# EAGLE design nedonand7 (EAGLE 5.12)
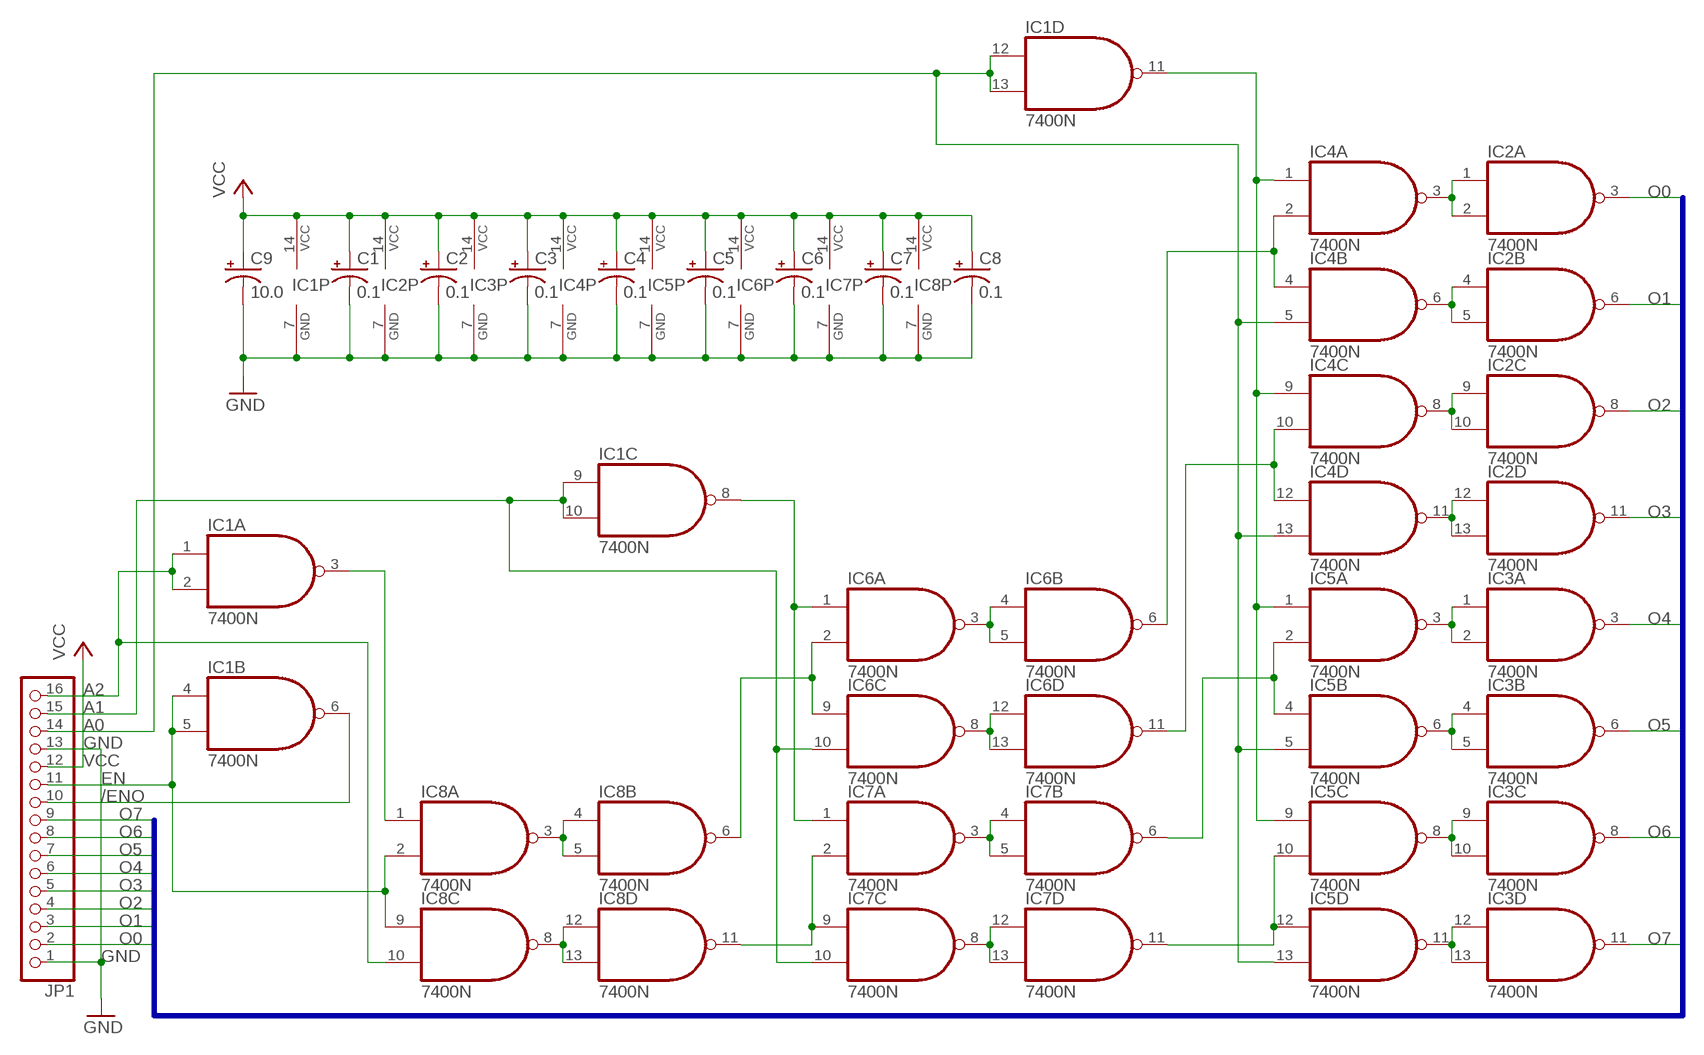
[diagram p0: schematic, sheet 1]

## Parts
C1  0.1  CPOL-USB45181A  [B45181A]
C2  0.1  CPOL-USB45181A  [B45181A]
C3  0.1  CPOL-USB45181A  [B45181A]
C4  0.1  CPOL-USB45181A  [B45181A]
C5  0.1  CPOL-USB45181A  [B45181A]
C6  0.1  CPOL-USB45181A  [B45181A]
C7  0.1  CPOL-USB45181A  [B45181A]
C8  0.1  CPOL-USB45181A  [B45181A]
C9  10.0  CPOL-USE2,5-6E  [E2,5-6E]
IC1  7400N  [DIL14]
IC2  7400N  [DIL14]
IC3  7400N  [DIL14]
IC4  7400N  [DIL14]
IC5  7400N  [DIL14]
IC6  7400N  [DIL14]
IC7  7400N  [DIL14]
IC8  7400N  [DIL14]
JP1  PINHD-1X16/90  [1X16/90]

## Nets
/ENO: IC1.6(B:O) JP1.10
A0: IC1.12(D:I0) IC1.13(D:I1) IC4.5(B:I1) IC4.13(D:I1) IC5.5(B:I1) IC5.13(D:I1) JP1.14
A1: IC1.9(C:I0) IC1.10(C:I1) IC6.10(C:I1) IC7.10(C:I1) JP1.15
A2: IC1.1(A:I0) IC1.2(A:I1) IC8.10(C:I1) JP1.16
EN: IC1.4(B:I0) IC1.5(B:I1) IC8.2(A:I1) IC8.9(C:I0) JP1.11
GND: C1.- C2.- C3.- C4.- C5.- C6.- C7.- C8.- C9.- IC1.7(P:GND) IC2.7(P:GND) IC3.7(P:GND) IC4.7(P:GND) IC5.7(P:GND) IC6.7(P:GND) IC7.7(P:GND) IC8.7(P:GND) JP1.1 JP1.13
N$1: IC8.3(A:O) IC8.4(B:I0) IC8.5(B:I1)
N$2: IC7.2(A:I1) IC7.9(C:I0) IC8.11(D:O)
N$7: IC8.8(C:O) IC8.12(D:I0) IC8.13(D:I1)
N$8: IC6.3(A:O) IC6.4(B:I0) IC6.5(B:I1)
N$9: IC6.8(C:O) IC6.12(D:I0) IC6.13(D:I1)
N$10: IC7.3(A:O) IC7.4(B:I0) IC7.5(B:I1)
N$11: IC7.8(C:O) IC7.12(D:I0) IC7.13(D:I1)
N$12: IC2.1(A:I0) IC2.2(A:I1) IC4.3(A:O)
N$13: IC2.4(B:I0) IC2.5(B:I1) IC4.6(B:O)
N$14: IC2.9(C:I0) IC2.10(C:I1) IC4.8(C:O)
N$15: IC2.12(D:I0) IC2.13(D:I1) IC4.11(D:O)
N$16: IC3.1(A:I0) IC3.2(A:I1) IC5.3(A:O)
N$17: IC3.4(B:I0) IC3.5(B:I1) IC5.6(B:O)
N$18: IC3.9(C:I0) IC3.10(C:I1) IC5.8(C:O)
N$19: IC3.12(D:I0) IC3.13(D:I1) IC5.11(D:O)
N$25: IC1.3(A:O) IC8.1(A:I0)
N$26: IC6.2(A:I1) IC6.9(C:I0) IC8.6(B:O)
N$28: IC1.8(C:O) IC6.1(A:I0) IC7.1(A:I0)
N$30: IC4.2(A:I1) IC4.4(B:I0) IC6.6(B:O)
N$31: IC4.10(C:I1) IC4.12(D:I0) IC6.11(D:O)
N$32: IC5.2(A:I1) IC5.4(B:I0) IC7.6(B:O)
N$33: IC5.10(C:I1) IC5.12(D:I0) IC7.11(D:O)
N$34: IC1.11(D:O) IC4.1(A:I0) IC4.9(C:I0) IC5.1(A:I0) IC5.9(C:I0)
O0: IC2.3(A:O) JP1.2
O1: IC2.6(B:O) JP1.3
O2: IC2.8(C:O) JP1.4
O3: IC2.11(D:O) JP1.5
O4: IC3.3(A:O) JP1.6
O5: IC3.6(B:O) JP1.7
O6: IC3.8(C:O) JP1.8
O7: IC3.11(D:O) JP1.9
VCC: C1.+ C2.+ C3.+ C4.+ C5.+ C6.+ C7.+ C8.+ C9.+ IC1.14(P:VCC) IC2.14(P:VCC) IC3.14(P:VCC) IC4.14(P:VCC) IC5.14(P:VCC) IC6.14(P:VCC) IC7.14(P:VCC) IC8.14(P:VCC) JP1.12

## Buses
O[0..7]

## Library data of the parts
C1-C9 = rcl:CPOL-US: POLARIZED CAPACITOR, American symbol
IC1-IC8 = 74xx-us:74*00: Quad 2-input NAND gate
JP1 = pinhead:PINHD-1X16: PIN HEADER

## Board
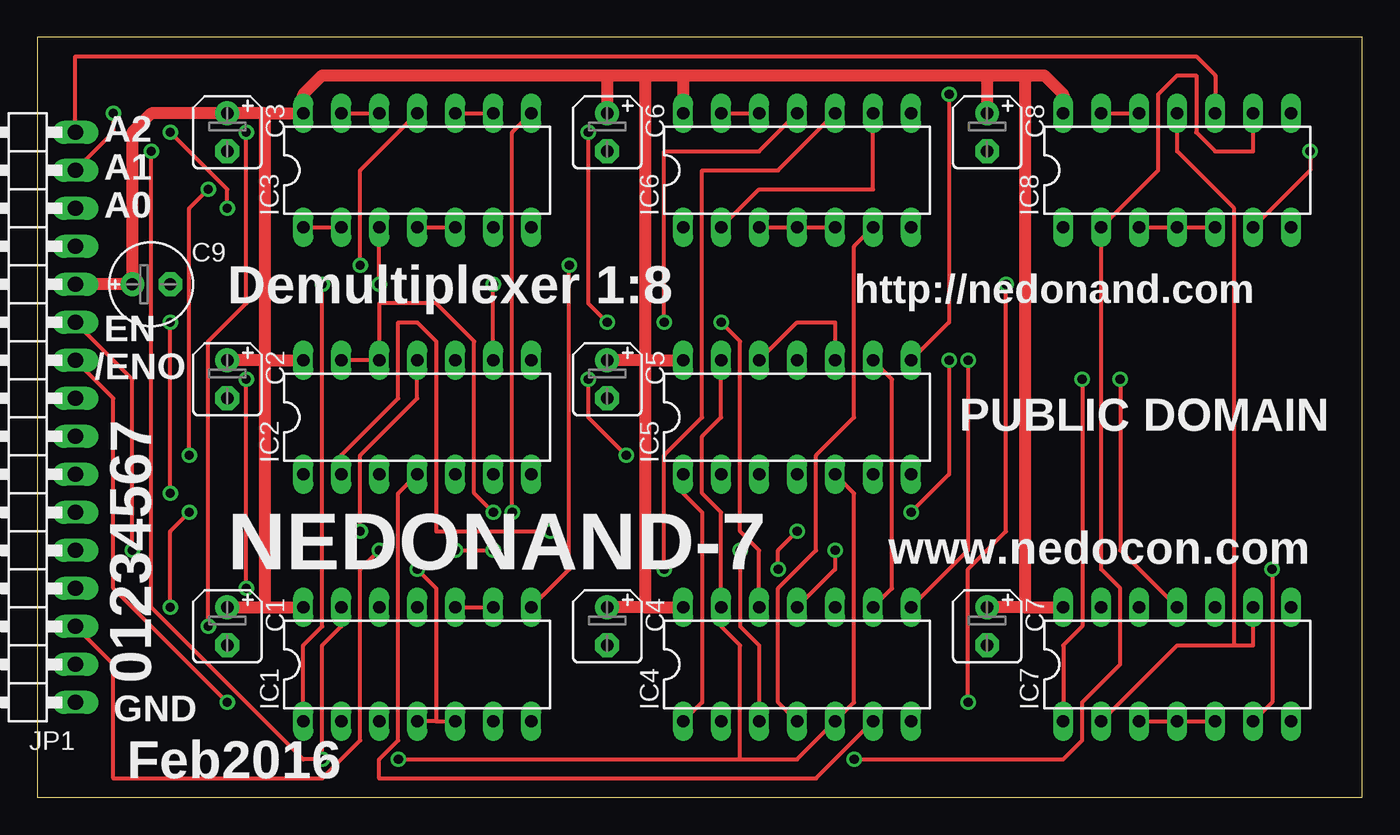
[diagram p1: board, top side]
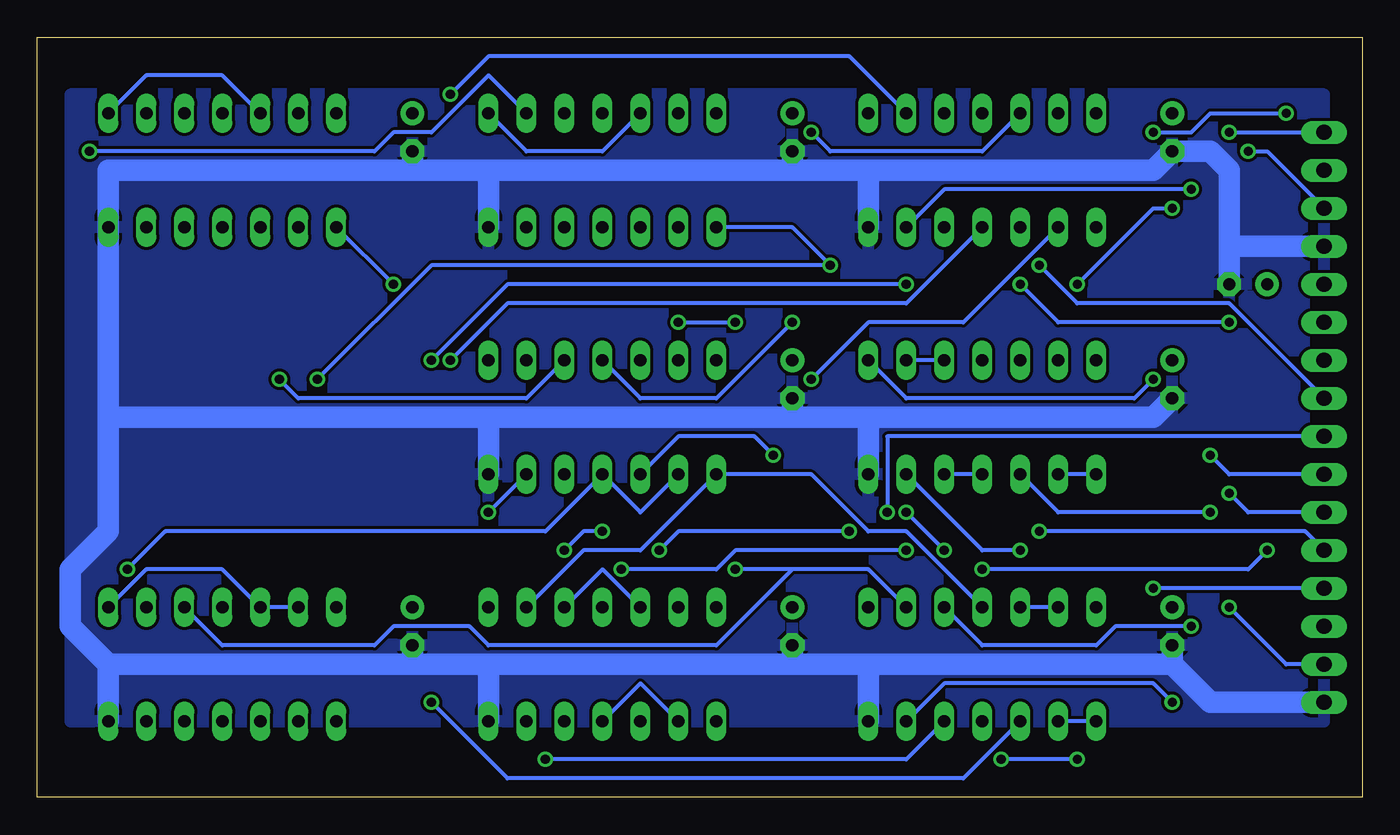
[diagram p2: board, bottom side, seen from below]

Size 88.57 x 50.79 mm. Coordinates in mm from the lower left corner, seen from the top.
Outline: 0,0 88.57,0 88.57,50.79 0,50.79 0,0
Copper layers (1*16): Top 0.035mm / dielectric 1.5mm / Bottom 0.035mm
Design rules "default": minimum track width 10mil, minimum drill 24mil, track to track 8mil, track to pad 8mil, pad to pad 8mil, via to via 8mil, smd to smd 8mil, copper to edge 40mil, drill to drill 8mil, minimum pad ring 10mil, minimum via ring 8mil, stop-mask expansion 4mil, vias tented up to drill 0mil, thermal gap 10mil

### Footprints (pad centres in the part's own frame; a part is rotated, then mirrored left to right if it is on the bottom)
B45181A = drill 0.813 pad 1.6 round: + -1.27,0 | drill 0.813 pad 1.6 octagon: - 1.27,0
E2,5-6E = drill 0.813 pad 1.575 round: + -1.27,0 | drill 0.813 pad 1.575 octagon: - 1.27,0
DIL14 = drill 0.813 long: 1 -7.62,-3.81; 2 -5.08,-3.81; 3 -2.54,-3.81; 4 0,-3.81; 5 2.54,-3.81; 6 5.08,-3.81; 7 7.62,-3.81; 8 7.62,3.81; 9 5.08,3.81; 10 2.54,3.81; 11 0,3.81; 12 -2.54,3.81; 13 -5.08,3.81; 14 -7.62,3.81
1X16/90 = drill 1.016 long: 1 -19.05,-3.81; 2 -16.51,-3.81; 3 -13.97,-3.81; 4 -11.43,-3.81; 5 -8.89,-3.81; 6 -6.35,-3.81; 7 -3.81,-3.81; 8 -1.27,-3.81; 9 1.27,-3.81; 10 3.81,-3.81; 11 6.35,-3.81; 12 8.89,-3.81; 13 11.43,-3.81; 14 13.97,-3.81; 15 16.51,-3.81; 16 19.05,-3.81

### Placement (x,y rotation side)
C1  12.7,11.43 270 top
C2  12.7,27.94 270 top
C3  12.7,44.45 270 top
C4  38.1,11.43 270 top
C5  38.1,27.94 270 top
C6  38.1,44.45 270 top
C7  63.5,11.43 270 top
C8  63.5,44.45 270 top
C9  7.62,34.29 0 top
IC1  25.4,8.89 0 top
IC2  25.4,25.4 0 top
IC3  25.4,41.91 0 top
IC4  50.8,8.89 0 top
IC5  50.8,25.4 0 top
IC6  50.8,41.91 0 top
IC7  76.2,8.89 0 top
IC8  76.2,41.91 0 top
JP1  -1.27,25.4 90 top

### Tracks (layer width: path | path; a pad name or v marks a point on that pad's centre or on a via)
/ENO  (via drill 0.61)
  Top 0.254: v12.7,6.35 5.08,13.97 5.08,26.67 JP1.10
  Bottom 0.254: IC1.6 27.94,7.62 13.97,7.62 v12.7,6.35
A0  (via drill 0.61)
  Top 0.254: IC5.5 54.61,20.32 54.61,6.35 IC4.5 50.8,2.54 46.99,2.54 | IC5.13 45.72,25.4 44.45,24.13 44.45,20.32 45.72,19.05 IC4.13 45.72,11.43 46.99,10.16 46.99,2.54 | v7.62,43.18 7.62,12.7 17.78,2.54 v19.05,2.54 19.05,10.16 20.32,11.43 IC1.13 | v24.13,2.54 46.99,2.54
  Bottom 0.254: IC1.13 IC1.12 | JP1.14 6.35,43.18 v7.62,43.18 | v19.05,2.54 v24.13,2.54
A1  (via drill 0.61)
  Top 0.254: IC1.10 IC1.9 | IC6.10 49.53,41.91 44.45,41.91 44.45,25.4 41.91,22.86 v41.91,15.24 | JP1.15 5.08,44.45 v5.08,45.72 | v13.97,44.45 13.97,33.02 11.43,30.48 v11.43,11.43
  Bottom 0.254: 38.1,15.24 33.02,15.24 IC1.9 | 38.1,15.24 v41.91,15.24 | IC7.10 76.2,10.16 66.04,10.16 64.77,11.43 59.69,11.43 58.42,10.16 43.18,10.16 38.1,15.24 | v5.08,45.72 10.16,45.72 11.43,44.45 v13.97,44.45 | v11.43,11.43 16.51,11.43 17.78,10.16 25.4,10.16 IC1.10
A2  (via drill 0.61)
  Top 0.254: IC8.10 78.74,48.26 77.47,49.53 2.54,49.53 JP1.16 | IC1.1 17.78,10.16 19.05,11.43 v19.05,34.29 | v12.7,39.37 12.7,40.64 v8.89,44.45
  Bottom 0.254: IC1.1 IC1.2 | v19.05,34.29 13.97,39.37 v12.7,39.37 | v8.89,44.45 JP1.16
EN  (via drill 0.61)
  Top 0.254: IC8.9 81.28,43.18 78.74,43.18 77.47,44.45 77.47,48.26 76.2,48.26 74.93,46.99 74.93,41.91 IC8.2 71.12,15.24 72.39,13.97 72.39,8.89 69.85,6.35 69.85,3.81 68.58,2.54 v54.61,2.54 | 26.67,5.08 IC1.5 | 26.67,5.08 IC1.4 | JP1.11 6.35,27.94 v6.35,16.51 | v25.4,15.24 26.67,13.97 26.67,5.08
  Bottom 0.254: v6.35,16.51 7.62,15.24 v25.4,15.24 | v54.61,2.54 30.48,2.54 IC1.5
GND
  Bottom 1.422: JP1.1 10.16,6.35 12.7,8.89 | 12.7,8.89 C1.- | 83.82,8.89 IC7.7 | 12.7,8.89 33.02,8.89 | 33.02,8.89 38.1,8.89 | 38.1,8.89 58.42,8.89 | 58.42,8.89 63.5,8.89 | 63.5,8.89 83.82,8.89 | 83.82,25.4 83.82,17.78 86.36,15.24 86.36,11.43 83.82,8.89 | 83.82,25.4 IC8.7 83.82,41.91 63.5,41.91 | 8.89,36.83 JP1.13 | 8.89,36.83 C9.- | 8.89,36.83 8.89,41.91 10.16,43.18 C3.- 13.97,41.91 33.02,41.91 | 33.02,41.91 IC3.7 | 63.5,41.91 58.42,41.91 | 58.42,41.91 38.1,41.91 | 38.1,41.91 33.02,41.91 | 63.5,41.91 C8.- | 58.42,41.91 IC6.7 | 38.1,41.91 C6.- | 63.5,8.89 C7.- | 38.1,8.89 C4.- | 33.02,8.89 IC1.7 | 58.42,8.89 IC4.7 | C2.- 13.97,25.4 33.02,25.4 | 83.82,25.4 58.42,25.4 | 58.42,25.4 38.1,25.4 | 38.1,25.4 33.02,25.4 | 58.42,25.4 IC5.7 | 38.1,25.4 C5.- | 33.02,25.4 IC2.7
  pour Bottom: 2.54,46.99 86.36,46.99 86.36,5.08 2.54,5.08
N$1
  Top 0.254: IC8.3 IC8.4 IC8.5
N$2
  Top 0.254: IC7.2 76.2,10.16 80.01,10.16 | 80.01,10.16 81.28,10.16 IC7.9 | IC8.11 76.2,43.18 80.01,39.37 80.01,10.16
N$7
  Top 0.254: IC8.13 IC8.12
  Bottom 0.254: IC8.8 81.28,48.26 76.2,48.26 IC8.12
N$8
  Top 0.254: IC6.3 IC6.4 IC6.5
N$9
  Top 0.254: IC6.13 IC6.12
  Bottom 0.254: IC6.8 55.88,43.18 50.8,43.18 IC6.12
N$10
  Top 0.254: IC7.3 IC7.4 IC7.5
N$11
  Bottom 0.254: IC7.13 IC7.12 76.2,15.24 81.28,15.24 IC7.8
N$12  (via drill 0.61)
  Top 0.254: IC4.3 48.26,10.16 46.99,11.43 v46.99,16.51 | v34.29,17.78 26.67,17.78 26.67,30.48 25.4,31.75 24.13,31.75 24.13,26.67 20.32,22.86 IC2.2
  Bottom 0.254: IC2.1 IC2.2 | v46.99,16.51 45.72,17.78 v34.29,17.78
N$13
  Top 0.254: IC4.6 52.07,1.27 22.86,1.27 22.86,2.54 24.13,3.81 24.13,20.32 IC2.4
  Bottom 0.254: IC2.4 IC2.5
N$14  (via drill 0.61)
  Top 0.254: IC4.8 62.23,16.51 v62.23,29.21 | IC2.9 v30.48,34.29
  Bottom 0.254: IC2.10 IC2.9 | v62.23,29.21 57.15,34.29 v30.48,34.29
N$15  (via drill 0.61)
  Top 0.254: IC2.13 IC2.12 22.86,33.02 26.67,33.02 29.21,30.48 29.21,20.32 v30.48,19.05 | IC4.11 53.34,15.24 v53.34,16.51 | v50.8,17.78 49.53,16.51 v49.53,15.24 | v27.94,16.51 v30.48,16.51
  Bottom 0.254: v53.34,16.51 52.07,17.78 v50.8,17.78 | v49.53,15.24 43.18,15.24 41.91,16.51 v30.48,16.51 | v27.94,16.51 v30.48,19.05
N$16  (via drill 0.61)
  Top 0.254: IC3.1 IC3.2 | v39.37,22.86 36.83,25.4 v36.83,27.94
  Bottom 0.254: IC5.3 45.72,24.13 40.64,24.13 v39.37,22.86 | v36.83,27.94 33.02,31.75 26.67,31.75 IC3.2
N$17  (via drill 0.61)
  Top 0.254: IC3.4 IC3.5 | v58.42,19.05 60.96,21.59 v60.96,29.21
  Bottom 0.254: v58.42,19.05 IC5.6 | v60.96,29.21 57.15,33.02 30.48,33.02 IC3.4
N$18  (via drill 0.61)
  Top 0.254: IC3.10 IC3.9 | IC5.8 60.96,31.75 v60.96,46.99
  Bottom 0.254: v60.96,46.99 58.42,49.53 34.29,49.53 IC3.9
N$19  (via drill 0.61)
  Top 0.254: IC3.13 IC3.12 | v38.1,31.75 36.83,33.02 v36.83,44.45
  Bottom 0.254: IC5.11 48.26,26.67 43.18,26.67 v38.1,31.75 | v36.83,44.45 35.56,43.18 25.4,43.18 IC3.12
N$25  (via drill 0.61)
  Top 0.254: v62.23,6.35 62.23,15.24 64.77,17.78 v64.77,34.29
  Bottom 0.254: IC1.3 26.67,1.27 57.15,1.27 v62.23,6.35 | v64.77,34.29 IC8.1
N$26  (via drill 0.61)
  Top 0.254: IC6.2 48.26,40.64 55.88,40.64 IC6.9 | IC8.6 85.09,41.91 v85.09,43.18
  Bottom 0.254: v85.09,43.18 66.04,43.18 64.77,44.45 62.23,44.45 58.42,48.26 IC6.9
N$28  (via drill 0.61)
  Top 0.254: IC1.8 35.56,15.24 v35.56,35.56 | IC7.1 68.58,10.16 69.85,11.43 v69.85,27.94
  Bottom 0.254: IC6.1 38.1,38.1 v35.56,35.56 62.23,35.56 v69.85,27.94
N$30
  Top 0.254: IC6.6 54.61,36.83 54.61,25.4 52.07,22.86 52.07,16.51 49.53,13.97 49.53,6.35 IC4.4
  Bottom 0.254: IC4.2 48.26,7.62 IC4.4
N$31  (via drill 0.61)
  Top 0.254: IC6.11 48.26,43.18 41.91,43.18 v41.91,31.75 | v45.72,31.75 46.99,30.48 46.99,17.78 48.26,16.51 IC4.12
  Bottom 0.254: IC4.12 50.8,15.24 IC4.10 | v45.72,31.75 v41.91,31.75
N$32  (via drill 0.61)
  Top 0.254: IC7.6 82.55,6.35 v82.55,15.24
  Bottom 0.254: IC5.2 48.26,19.05 IC5.4 54.61,17.78 80.01,17.78 v82.55,15.24
N$33  (via drill 0.61)
  Top 0.254: IC5.12 50.8,31.75 53.34,31.75 IC5.10 | IC7.11 72.39,16.51 v72.39,27.94
  Bottom 0.254: v72.39,27.94 71.12,26.67 55.88,26.67 IC5.10
N$34
  Top 0.254: IC4.1 44.45,6.35 44.45,19.05 43.18,20.32 IC5.1 | IC5.9 57.15,27.94 57.15,13.97 IC4.9
  Bottom 0.254: IC1.11 30.48,17.78 33.02,17.78 36.83,21.59 IC5.1 48.26,16.51 52.07,16.51 IC4.9
O0  (via drill 0.61)
  Top 0.254: v10.16,19.05 8.89,17.78 v8.89,12.7
  Bottom 0.254: IC2.3 20.32,19.05 v10.16,19.05 | v8.89,12.7 5.08,8.89 JP1.2
O1  (via drill 0.61)
  Top 0.254: v22.86,16.51 21.59,15.24 21.59,3.81 19.05,1.27 5.08,1.27 5.08,8.89 JP1.3
  Bottom 0.254: IC2.6 25.4,16.51 v22.86,16.51
O2  (via drill 0.61)
  Top 0.254: v13.97,13.97 v13.97,27.94
  Bottom 0.254: IC2.8 30.48,26.67 15.24,26.67 v13.97,27.94 | JP1.4 v13.97,13.97
O3  (via drill 0.61)
  Top 0.254: IC2.11 25.4,26.67 21.59,22.86 v21.59,17.78
  Bottom 0.254: v21.59,17.78 3.81,17.78 JP1.5
O4  (via drill 0.61)
  Top 0.254: v22.86,34.29 IC3.3 | v8.89,20.32 v8.89,31.75
  Bottom 0.254: v22.86,34.29 20.32,31.75 v8.89,31.75 | v8.89,20.32 7.62,19.05 JP1.6
O5  (via drill 0.61)
  Top 0.254: v11.43,40.64 10.16,39.37 v10.16,22.86
  Bottom 0.254: IC3.6 27.94,40.64 v11.43,40.64 | v10.16,22.86 8.89,21.59 JP1.7
O6  (via drill 0.61)
  Top 0.254: IC3.8 31.75,44.45 v31.75,19.05
  Bottom 0.254: v31.75,19.05 31.75,24.13 JP1.8
O7  (via drill 0.61)
  Top 0.254: IC3.11 21.59,41.91 v21.59,35.56
  Bottom 0.254: v21.59,35.56 19.05,33.02 8.89,33.02 JP1.9
VCC
  Top 0.813: JP1.12 C9.+ 6.35,44.45 7.62,45.72 C3.+ 15.24,45.72 | 15.24,45.72 IC3.14 17.78,46.99 19.05,48.26 38.1,48.26 | 38.1,48.26 40.64,48.26 | 40.64,48.26 43.18,48.26 | 43.18,48.26 63.5,48.26 | 63.5,48.26 66.04,48.26 | 66.04,48.26 67.31,48.26 68.58,46.99 IC8.14 | 63.5,48.26 C8.+ | 43.18,48.26 IC6.14 | 38.1,48.26 C6.+ | 15.24,29.21 IC2.14 | 15.24,29.21 15.24,45.72 | 15.24,12.7 IC1.14 | 15.24,12.7 15.24,29.21 | 40.64,29.21 IC5.14 | 40.64,48.26 40.64,29.21 | 40.64,12.7 IC4.14 | 40.64,29.21 40.64,12.7 | 66.04,12.7 IC7.14 | 66.04,48.26 66.04,12.7 | 66.04,12.7 C7.+ | 40.64,12.7 C4.+ | C1.+ 15.24,12.7 | 15.24,29.21 C2.+ | 40.64,29.21 C5.+

### Text on the board
tNames: A2 | A1 | A0 | Demultiplexer 1:8 | http://nedonand.com | EN | /ENO | PUBLIC DOMAIN | www.nedocon.com | NEDONAND-7 | 01234567 | GND | Feb2016